# Altium project QUTMS-SHDN-BSPD-V00.PrjPcb
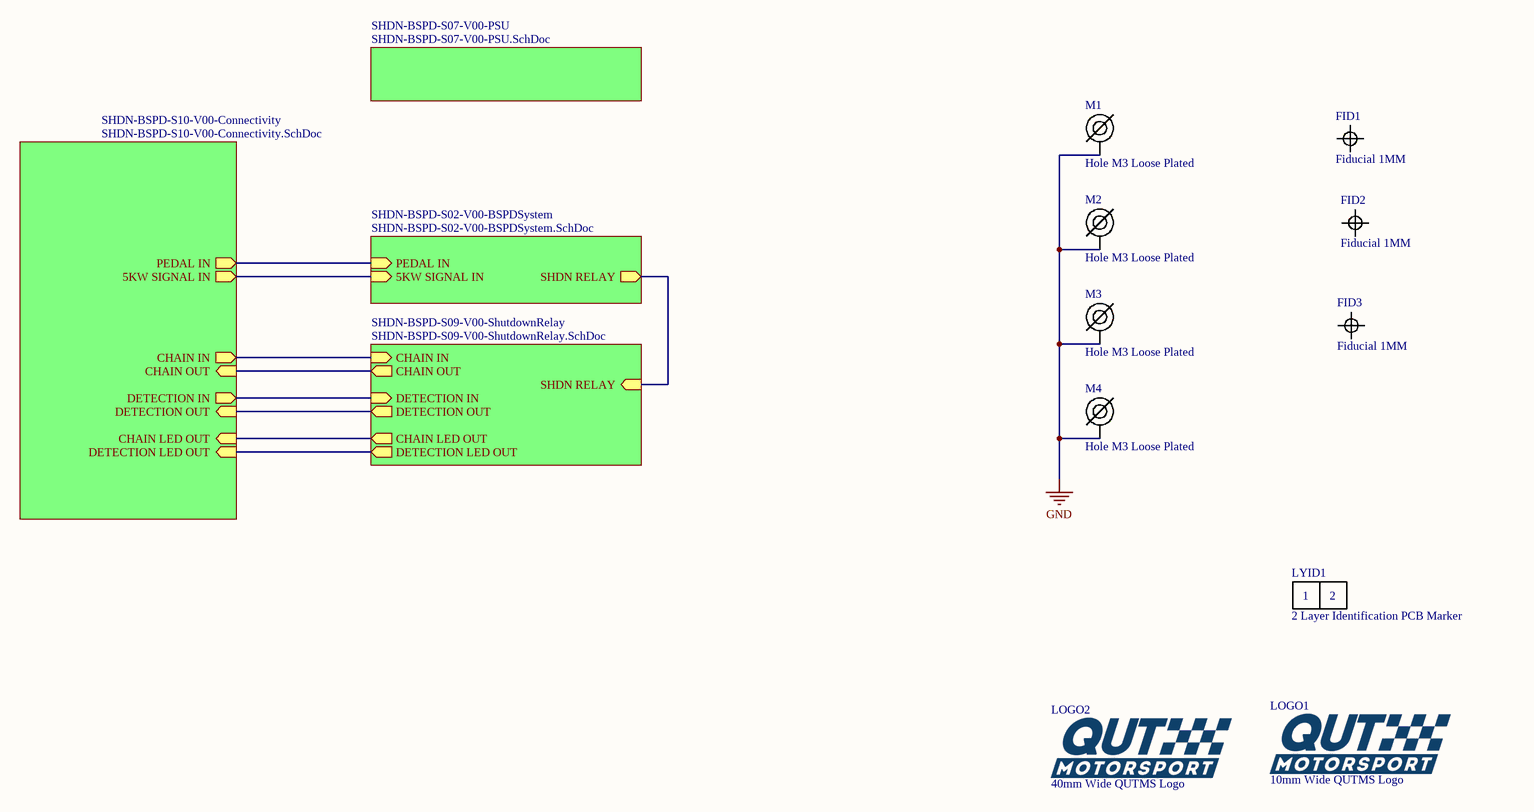
[diagram p0: SHDN-BSPD-S01-V00-BSPDBoard.SchDoc]
10 sheets, 113 parts. Net scope: hierarchical (ports join the sheet entries above them; power ports are global).
Board file: SHDN-BSPD-B01-V00.PcbDoc
Sheets:
  SHDN-BSPD-S01-V00-BSPDBoard.SchDoc
    SHDN-BSPD-S10-V00-Connectivity = SHDN-BSPD-S10-V00-Connectivity.SchDoc
    SHDN-BSPD-S02-V00-BSPDSystem = SHDN-BSPD-S02-V00-BSPDSystem.SchDoc
      SHDN-BSPD-S03-V00-BSPDWindowComparitor = SHDN-BSPD-S03-V00-BSPDWindowComparitor.SchDoc
      SHDN-BSPD-S04-V00-BSPDDelay = SHDN-BSPD-S04-V00-BSPDDelay.SchDoc
      SHDN-BSPD-S03-V00-BSPDWindowComparitor = SHDN-BSPD-S03-V00-BSPDWindowComparitor.SchDoc
    SHDN-BSPD-S07-V00-PSU = SHDN-BSPD-S07-V00-PSU.SchDoc
    SHDN-BSPD-S09-V00-ShutdownRelay = SHDN-BSPD-S09-V00-ShutdownRelay.SchDoc
  SHDN-BSPD-S05-V00-Microcontroller.SchDoc
  SHDN-BSPD-S06-V00-IsolatedCAN.SchDoc
  SHDN-BSPD-S08-V00-Buzzer.SchDoc

## Sheet SHDN-BSPD-S01-V00-BSPDBoard.SchDoc: Brake System Plausability Device - BSPD
size A3; DrawnBy: Jonn Dillon; DocumentNumber: 1; Revision: 01; SheetNumber: 1; SheetTotal: 10

### Parts
FID1  Fiducial 1MM  [FIDUCIAL 1MM]
FID2  Fiducial 1MM  [FIDUCIAL 1MM]
FID3  Fiducial 1MM  [FIDUCIAL 1MM]
LOGO1  10mm Wide QUTMS Logo  [QUTMS LOGO 10MM]
LOGO2  40mm Wide QUTMS Logo  [QUTMS LOGO 40MM]
LYID1  2 Layer Identification PCB Marker  [LAYER IDENT 2]
M1  Hole M3 Loose Plated  [M3.5 PLATED]
M2  Hole M3 Loose Plated  [M3.5 PLATED]
M3  Hole M3 Loose Plated  [M3.5 PLATED]
M4  Hole M3 Loose Plated  [M3.5 PLATED]

### Sub-sheets
SHDN-BSPD-S02-V00-BSPDSystem = SHDN-BSPD-S02-V00-BSPDSystem.SchDoc: PEDAL IN (in), 5KW SIGNAL IN (in), SHDN RELAY (out)
SHDN-BSPD-S07-V00-PSU = SHDN-BSPD-S07-V00-PSU.SchDoc: no entries
SHDN-BSPD-S09-V00-ShutdownRelay = SHDN-BSPD-S09-V00-ShutdownRelay.SchDoc: CHAIN OUT (out), CHAIN IN (in), SHDN RELAY (in), DETECTION IN (in), DETECTION OUT (out), CHAIN LED OUT (out), DETECTION LED OUT (out)
SHDN-BSPD-S10-V00-Connectivity = SHDN-BSPD-S10-V00-Connectivity.SchDoc: CHAIN IN (out), CHAIN OUT (in), PEDAL IN (out), 5KW SIGNAL IN (out), DETECTION IN (out), DETECTION OUT (in), CHAIN LED OUT (in), DETECTION LED OUT (in)

### Nets
GND: M1.1 M2.1 M3.1 M4.1
5KW SIGNAL IN: sheet SHDN-BSPD-S10-V00-Connectivity/5KW SIGNAL IN, sheet SHDN-BSPD-S02-V00-BSPDSystem/5KW SIGNAL IN
BSPD10: sheet SHDN-BSPD-S02-V00-BSPDSystem/SHDN RELAY, sheet SHDN-BSPD-S09-V00-ShutdownRelay/SHDN RELAY
CHAIN IN: sheet SHDN-BSPD-S10-V00-Connectivity/CHAIN IN, sheet SHDN-BSPD-S09-V00-ShutdownRelay/CHAIN IN
CHAIN LED: sheet SHDN-BSPD-S10-V00-Connectivity/CHAIN LED OUT, sheet SHDN-BSPD-S09-V00-ShutdownRelay/CHAIN LED OUT
CHAIN OUT: sheet SHDN-BSPD-S10-V00-Connectivity/CHAIN OUT, sheet SHDN-BSPD-S09-V00-ShutdownRelay/CHAIN OUT
DET LED: sheet SHDN-BSPD-S10-V00-Connectivity/DETECTION LED OUT, sheet SHDN-BSPD-S09-V00-ShutdownRelay/DETECTION LED OUT
DETECTION IN: sheet SHDN-BSPD-S10-V00-Connectivity/DETECTION IN, sheet SHDN-BSPD-S09-V00-ShutdownRelay/DETECTION IN
DETECTION OUT: sheet SHDN-BSPD-S10-V00-Connectivity/DETECTION OUT, sheet SHDN-BSPD-S09-V00-ShutdownRelay/DETECTION OUT
PEDAL IN: sheet SHDN-BSPD-S10-V00-Connectivity/PEDAL IN, sheet SHDN-BSPD-S02-V00-BSPDSystem/PEDAL IN

### Notes on the sheet
- Revision History:
- Sheet Title:
- Rev
- Date
- Description
- Project:
- Size:
- Drawn By:
- A3
- Number:
- Revision:
- Sheet
- Version:
- of
- QUT Motorsport
- O-120, Gardens Point
- 2 George Street
- Brisbane, QLD 4000
- Australia
- Print Date:
- Print Time:
- File Name:
- (in symbol Layer Identification 2) 1; 2

### Library data of the parts
LOGO1 = QUTMS Logo 10mm
LOGO2 = QUTMS Logo 40mm
LYID1 = Layer Identification 2
M1-M4 = Hole M3 Loose Plated: M3.5 Hole, Plated

## Sheet SHDN-BSPD-S10-V00-Connectivity.SchDoc: 8 Pin Connector
size A3; DrawnBy: Jonn Dillon; DocumentNumber: 10; Revision: 01; SheetNumber: 10; SheetTotal: 10
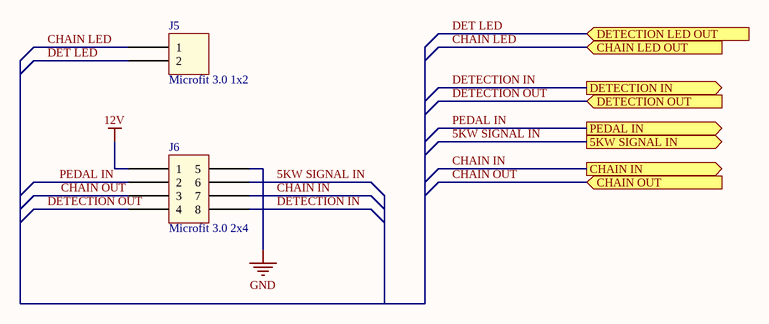
[diagram p1: SHDN-BSPD-S10-V00-Connectivity.SchDoc]

### Parts
J5  Microfit 3.0 1x2  [Microfit_1X2_R_TH]
J6  Microfit 3.0 2x4  [Microfit_2X4_R_TH]

### Ports
5KW SIGNAL IN (out), CHAIN IN (out), CHAIN LED OUT (in), CHAIN OUT (in), DETECTION IN (out), DETECTION LED OUT (in), DETECTION OUT (in), PEDAL IN (out)

### Nets
12V: J6.1
GND: J6.5
5KW SIGNAL IN: J6.6 ; port 5KW SIGNAL IN
CHAIN IN: J6.7 ; port CHAIN IN
CHAIN LED: J5.1 ; port CHAIN LED OUT
CHAIN OUT: J6.3 ; port CHAIN OUT
DET LED: J5.2 ; port DETECTION LED OUT
DETECTION IN: J6.8 ; port DETECTION IN
DETECTION OUT: J6.4 ; port DETECTION OUT
PEDAL IN: J6.2 ; port PEDAL IN

### Notes on the sheet
- Revision History:
- Sheet Title:
- Rev
- Date
- Description
- Project:
- Size:
- Drawn By:
- A3
- Number:
- Revision:
- Sheet
- Version:
- of
- QUT Motorsport
- O-120, Gardens Point
- 2 George Street
- Brisbane, QLD 4000
- Australia
- Print Date:
- Print Time:
- File Name:

### Library data of the parts
J5 = Microfit_1x2
J6 = Microfit_2x4

## Sheet SHDN-BSPD-S02-V00-BSPDSystem.SchDoc: BSPD System
size A3; DrawnBy: Jonn Dillon; DocumentNumber: 2; Revision: 01; SheetNumber: 2; SheetTotal: 10
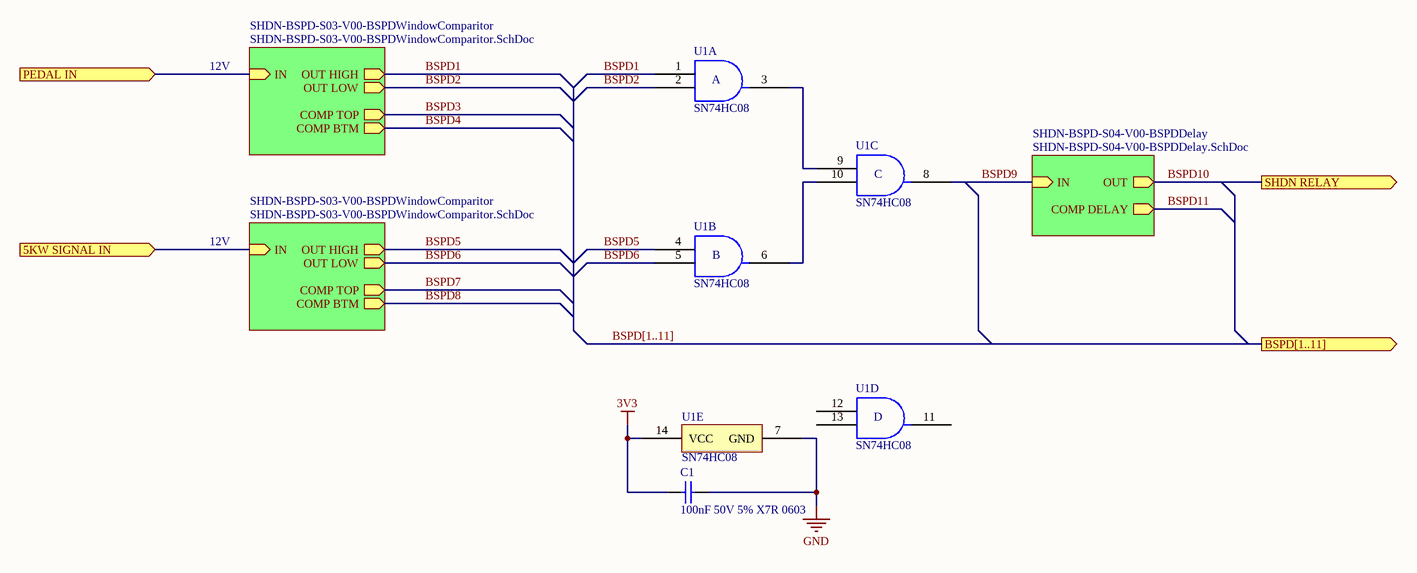
[diagram p2: SHDN-BSPD-S02-V00-BSPDSystem.SchDoc]

### Parts
C1  100nF 50V 5% X7R 0603  [Cap_Ceramic_0603]
U1  SN74HC08  [TSSOP-14]  (parts A,B,C,D,E of 5)

### Sub-sheets
SHDN-BSPD-S03-V00-BSPDWindowComparitor = SHDN-BSPD-S03-V00-BSPDWindowComparitor.SchDoc: COMP TOP (out), IN (in), COMP BTM (out), OUT HIGH (out), OUT LOW (out)
SHDN-BSPD-S03-V00-BSPDWindowComparitor = SHDN-BSPD-S03-V00-BSPDWindowComparitor.SchDoc: COMP TOP (out), IN (in), COMP BTM (out), OUT HIGH (out), OUT LOW (out)
SHDN-BSPD-S04-V00-BSPDDelay = SHDN-BSPD-S04-V00-BSPDDelay.SchDoc: IN (in), OUT (out), COMP DELAY (out)

### Ports
5KW SIGNAL IN (in), BSPD[1..11] (out), PEDAL IN (in), SHDN RELAY (out)

### Nets
3V3: C1.2 U1.14(VCC)
GND: C1.1 U1.7(GND)
5KW SIGNAL IN: port 5KW SIGNAL IN, sheet SHDN-BSPD-S03-V00-BSPDWindowComparitor/IN
BSPD1: U1.1(1A) ; sheet SHDN-BSPD-S03-V00-BSPDWindowComparitor/OUT HIGH
BSPD2: U1.2(1B) ; sheet SHDN-BSPD-S03-V00-BSPDWindowComparitor/OUT LOW
BSPD5: U1.4(2A) ; sheet SHDN-BSPD-S03-V00-BSPDWindowComparitor/OUT HIGH
BSPD6: U1.5(2B) ; sheet SHDN-BSPD-S03-V00-BSPDWindowComparitor/OUT LOW
BSPD9: U1.8(3Y) ; sheet SHDN-BSPD-S04-V00-BSPDDelay/IN
BSPD10: port SHDN RELAY, sheet SHDN-BSPD-S04-V00-BSPDDelay/OUT
PEDAL IN: port PEDAL IN, sheet SHDN-BSPD-S03-V00-BSPDWindowComparitor/IN
NetU1_3: U1.3(1Y) U1.9(3A)
NetU1_6: U1.6(2Y) U1.10(3B)

Not connected (* = marked no-connect by the designer): U1 11(4Y) 12(4A) 13(4B)

### Buses and harness runs
bus BSPD[1..11] = port BSPD[1..11]

### Notes on the sheet
- 12V
- Revision History:
- Sheet Title:
- Rev
- Date
- Description
- Project:
- Size:
- Drawn By:
- A3
- Number:
- Revision:
- Sheet
- Version:
- of
- QUT Motorsport
- O-120, Gardens Point
- 2 George Street
- Brisbane, QLD 4000
- Australia
- Print Date:
- Print Time:
- File Name:
- (in symbol SN74HC08, part A) A
- (in symbol SN74HC08, part B) B
- (in symbol SN74HC08, part C) C
- (in symbol SN74HC08, part D) D

### Library data of the parts
C1 = 100nF 50V 5% X7R 0603: Capacitor, Ceramic, SMD, 100nF, 50V, 5%, X7R, 0603
U1 = SN74HC08: Quadruple 2-Input Positive-AND Gates

## Sheet SHDN-BSPD-S03-V00-BSPDWindowComparitor.SchDoc: Window Comparitor
size A3; DrawnBy: Jonn Dillon; DocumentNumber: 3; Revision: 01; SheetNumber: 3; SheetTotal: 10
Used 2 times, as channels SHDN-BSPD-S02-V00-BSPDSystem/SHDN-BSPD-S03-V00-BSPDWindowComparitor, SHDN-BSPD-S02-V00-BSPDSystem/SHDN-BSPD-S03-V00-BSPDWindowComparitor. Parts and nets are listed once, with the designators drawn on the sheet.
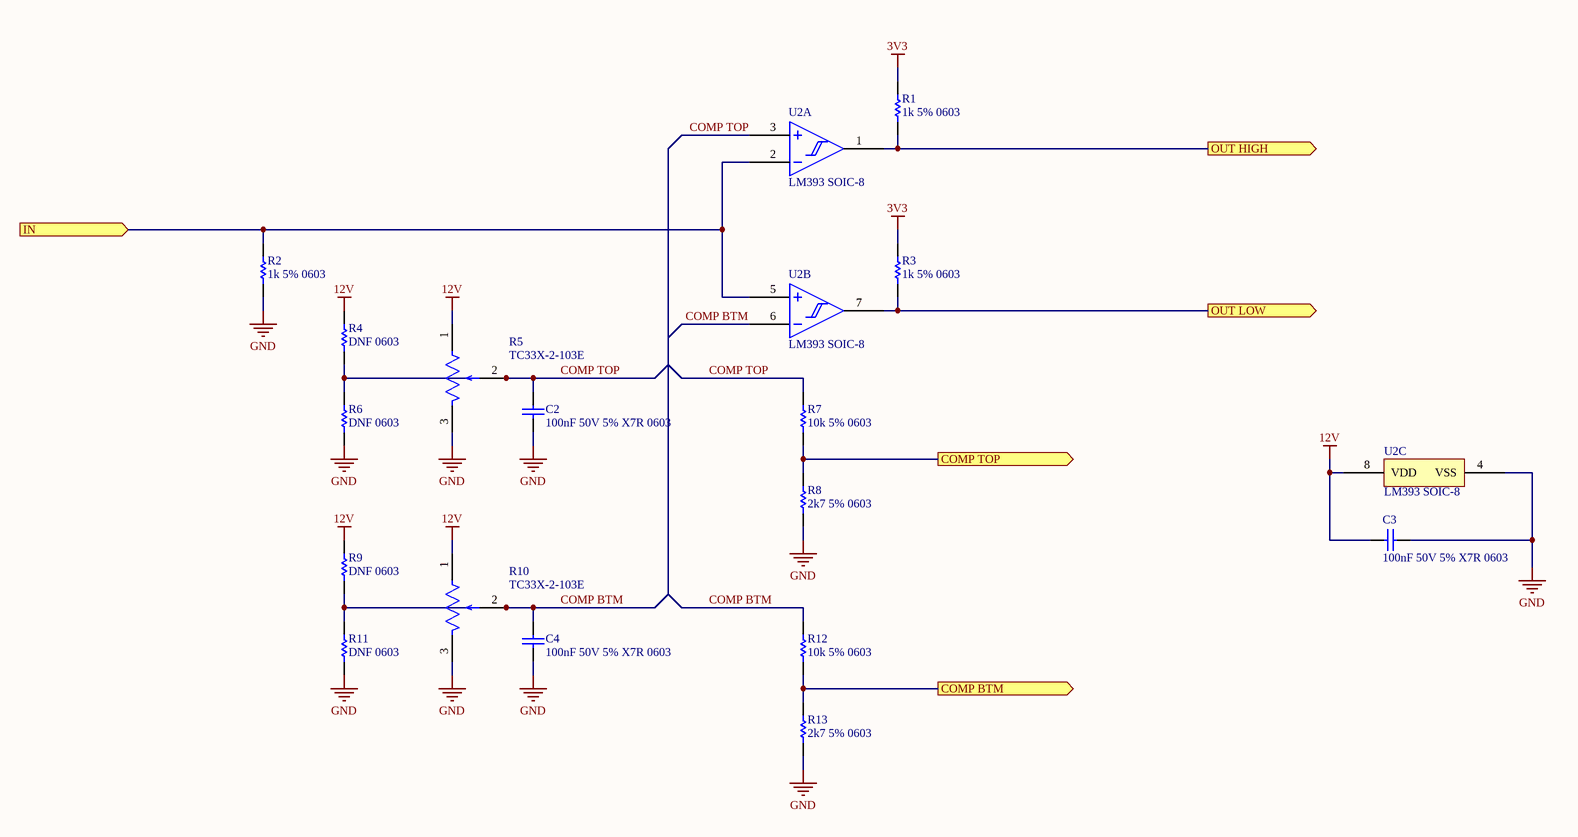
[diagram p3: SHDN-BSPD-S03-V00-BSPDWindowComparitor.SchDoc]

### Parts
C2  100nF 50V 5% X7R 0603  [Cap_Ceramic_0603]
C3  100nF 50V 5% X7R 0603  [Cap_Ceramic_0603]
C4  100nF 50V 5% X7R 0603  [Cap_Ceramic_0603]
R1  1k 5% 0603  [Res_ThinFilm_0603]
R2  1k 5% 0603  [Res_ThinFilm_0603]
R3  1k 5% 0603  [Res_ThinFilm_0603]
R4  DNF 0603  [Res_ThinFilm_0603]
R5  TC33X-2-103E  [TC33]
R6  DNF 0603  [Res_ThinFilm_0603]
R7  10k 5% 0603  [Res_ThinFilm_0603]
R8  2k7 5% 0603  [Res_ThinFilm_0603]
R9  DNF 0603  [Res_ThinFilm_0603]
R10  TC33X-2-103E  [TC33]
R11  DNF 0603  [Res_ThinFilm_0603]
R12  10k 5% 0603  [Res_ThinFilm_0603]
R13  2k7 5% 0603  [Res_ThinFilm_0603]
U2  LM393 SOIC-8  [SOIC-8]  (parts A,B,C of 3)

### Ports
COMP BTM (out), COMP TOP (out), IN (in), OUT HIGH (out), OUT LOW (out)

### Nets
3V3: R1.2 R3.2
12V: C3.1 R4.2 R5.1 R9.2 R10.1 U2.8(VDD)
GND: C2.1 C3.2 C4.1 R2.1 R5.3 R6.1 R8.1 R10.3 R11.1 R13.1 U2.4(VSS)
COMP BTM: C4.2 R9.1 R10.2 R11.2 R12.1 U2.6(IN2-)
COMP BTM: R12.2 R13.2 ; port COMP BTM  [a separate net that carries the same name]
COMP TOP: C2.2 R4.1 R5.2 R6.2 R7.1 U2.3(IN1+)
COMP TOP: R7.2 R8.2 ; port COMP TOP  [a separate net that carries the same name]
IN: R2.2 U2.2(IN1-) U2.5(IN2+) ; port IN
OUT HIGH: R1.1 U2.1(OUT1) ; port OUT HIGH
OUT LOW: R3.1 U2.7(OUT1) ; port OUT LOW

### Channels
SHDN-BSPD-S02-V00-BSPDSystem/SHDN-BSPD-S03-V00-BSPDWindowComparitor: designators end in B; ports COMP BTM=BSPD4 COMP TOP=BSPD3 IN=PEDAL IN OUT HIGH=BSPD1 OUT LOW=BSPD2
SHDN-BSPD-S02-V00-BSPDSystem/SHDN-BSPD-S03-V00-BSPDWindowComparitor: designators end in A; ports COMP BTM=BSPD8 COMP TOP=BSPD7 IN=5KW SIGNAL IN OUT HIGH=BSPD5 OUT LOW=BSPD6

### Notes on the sheet
- Revision History:
- Sheet Title:
- Rev
- Date
- Description
- Project:
- Size:
- Drawn By:
- A3
- Number:
- Revision:
- Sheet
- Version:
- of
- QUT Motorsport
- O-120, Gardens Point
- 2 George Street
- Brisbane, QLD 4000
- Australia
- Print Date:
- Print Time:
- File Name:

### Library data of the parts
C2-C4 = 100nF 50V 5% X7R 0603: as C1 on sheet SHDN-BSPD-S02-V00-BSPDSystem
R1-R3 = 1k 5% 0603: Resistor, SMD, 1k, 0.1W, 5%, 0603
R4 R6 R9 R11 = DNF 0603: Resistor, SMD, DNF, 0.1W, 0603
R5 R10 = TC33X-2-103E: 10 kOhms 0.1W, 1/10W J Lead Surface Mount Trimmer Potentiometer Cermet 1 Turn Top Adjustment
R7 R12 = 10k 5% 0603: Resistor, SMD, 10k, 0.1W, 5%, 0603
R8 R13 = 2k7 5% 0603: Resistor, SMD, 2k7, 0.1W, 5%, 0603
U2 = LM393: General Purpose Comparitor 2 Circuit 8-SOIC

## Sheet SHDN-BSPD-S04-V00-BSPDDelay.SchDoc: RC Charging Delay
size A3; DrawnBy: Jonn Dillon; DocumentNumber: 4; Revision: 01; SheetNumber: 4; SheetTotal: 10
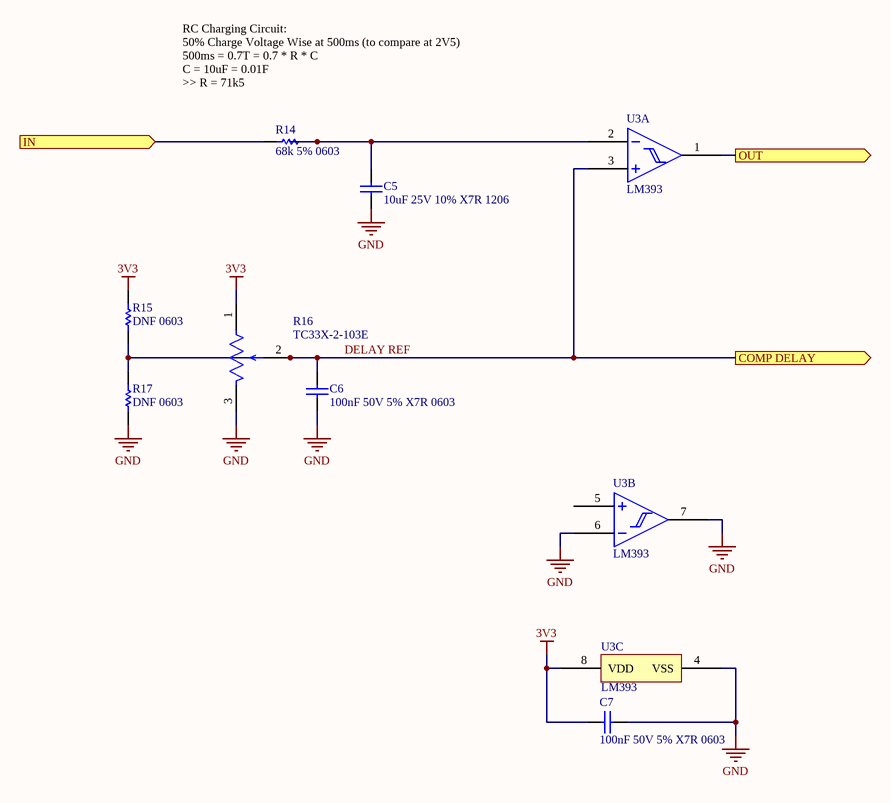
[diagram p4: SHDN-BSPD-S04-V00-BSPDDelay.SchDoc]

### Parts
C5  10uF 25V 10% X7R 1206  [Cap_Ceramic_1206]
C6  100nF 50V 5% X7R 0603  [Cap_Ceramic_0603]
C7  100nF 50V 5% X7R 0603  [Cap_Ceramic_0603]
R14  68k 5% 0603  [Res_ThinFilm_0603]
R15  DNF 0603  [Res_ThinFilm_0603]
R16  TC33X-2-103E  [TC33]
R17  DNF 0603  [Res_ThinFilm_0603]
U3  LM393  [TSSOP-8]  (parts A,B,C of 3)

### Ports
COMP DELAY (out), IN (in), OUT (out)

### Nets
3V3: C7.2 R15.2 R16.1 U3.8(VDD)
GND: C5.1 C6.1 C7.1 R16.3 R17.1 U3.4(VSS) U3.6(IN2-) U3.7(OUT1)
BSPD9: R14.1 ; port IN
BSPD10: U3.1(OUT1) ; port OUT
DELAY REF: C6.2 R15.1 R16.2 R17.2 U3.3(IN1+) ; port COMP DELAY  [project net BSPD11]
NetC5_2: C5.2 R14.2 U3.2(IN1-)

Not connected (* = marked no-connect by the designer): U3 5(IN2+)

### Notes on the sheet
- RC Charging Circuit:
  50% Charge Voltage Wise at 500ms (to compare at 2V5)
  500ms = 0.7T = 0.7 * R * C
  C = 10uF = 0.01F
  >> R = 71k5
- Revision History:
- Sheet Title:
- Rev
- Date
- Description
- Project:
- Size:
- Drawn By:
- A3
- Number:
- Revision:
- Sheet
- Version:
- of
- QUT Motorsport
- O-120, Gardens Point
- 2 George Street
- Brisbane, QLD 4000
- Australia
- Print Date:
- Print Time:
- File Name:

### Library data of the parts
C5 = 10uF 25V 10% X7R 1206: Capacitor, Ceramic, SMD, 10uF, 25V, 10%, X7R, 1206
C6 C7 = 100nF 50V 5% X7R 0603: as C1 on sheet SHDN-BSPD-S02-V00-BSPDSystem
R14 = 68k 5% 0603: Resistor, SMD, 68k, 0.1W, 5%, 0603
R15 R17 = DNF 0603: Resistor, SMD, DNF, 0.1W, 0603
R16 = TC33X-2-103E: as R5 on sheet SHDN-BSPD-S03-V00-BSPDWindowComparitor
U3 = LM393: as U2 on sheet SHDN-BSPD-S03-V00-BSPDWindowComparitor

## Sheet SHDN-BSPD-S07-V00-PSU.SchDoc: Power Supply (20-40V to 3v3 @ 0.1-0.6A)
size A3; DrawnBy: Jonn Dillon; DocumentNumber: 7; Revision: 01; SheetNumber: 7; SheetTotal: 10; Version: 01; Project: Battery Management System 2020; PageSetup: Record=PageOptions|CenterHorizontal=True|CenterVertical=True|PrintScale=0.97|XCorrection=1.00|YCorrection=1.00|PrintKind=0|BorderSize=5000000|LeftOffset=0|BottomOffset=0|Orientation=2|PaperLength=1000|PaperWidth=1000|Scale=100|PaperSource=7|PrintQuality=-4|MediaType=1|DitherType=10|PaperKind=A4|PrintScaleMode=1
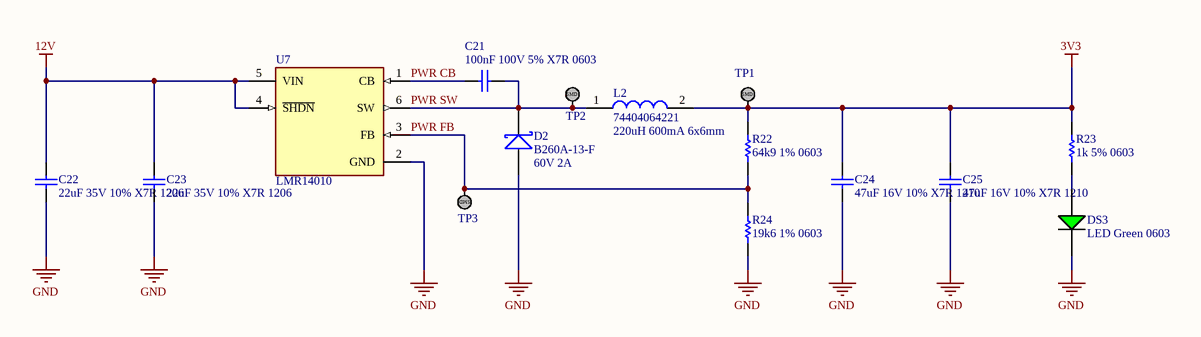
[diagram p5: SHDN-BSPD-S07-V00-PSU.SchDoc]

### Parts
C21  100nF 100V 5% X7R 0603  [Cap_Ceramic_0603]
C22  22uF 35V 10% X7R 1206  [Cap_Ceramic_1206]
C23  22uF 35V 10% X7R 1206  [Cap_Ceramic_1206]
C24  47uF 16V 10% X7R 1210  [Cap_Ceramic_1210]
C25  47uF 16V 10% X7R 1210  [Cap_Ceramic_1210]
D2  B260A-13-F  [SMA]
DS3  LED Green 0603  [LED GREEN 0603]
L2  74404064221  [Inductor_6x6mm]
R22  64k9 1% 0603  [Res_ThinFilm_0603]
R23  1k 5% 0603  [Res_ThinFilm_0603]
R24  19k6 1% 0603  [Res_ThinFilm_0603]
TP1  TestPoint_SMD  [TestPointSMD]  (value not drawn)
TP2  TestPoint_SMD  [TestPointSMD]  (value not drawn)
TP3  TestPoint_SMD  [TestPointSMD]  (value not drawn)
U7  LMR14010  [LMR14010]

### Nets
3V3: C24.2 C25.2 L2.2 R22.2 R23.2 TP1.1
12V: C22.2 C23.2 U7.4(~{SHDN}) U7.5(VIN)
GND: C22.1 C23.1 C24.1 C25.1 D2.A DS3.2(C) R24.1 U7.2(GND)
PWR CB: C21.1 U7.1(CB)
PWR FB: R22.1 R24.2 TP3.1 U7.3(FB)
PWR SW: C21.2 D2.K L2.1 TP2.1 U7.6(SW)
NetDS3_1: DS3.1(A) R23.1

### Notes on the sheet
- (near L2) 220uH 600mA 6x6mm
- (near D2) 60V 2A
- Revision History:
- Sheet Title:
- Rev
- Date
- Description
- Project:
- Size:
- Drawn By:
- A3
- Number:
- Revision:
- Sheet
- Version:
- of
- QUT Motorsport
- O-120, Gardens Point
- 2 George Street
- Brisbane, QLD 4000
- Australia
- Print Date:
- Print Time:
- File Name:
- (in symbol TestPoint_SMD) SMD

### Library data of the parts
C21 = 100nF 100V 5% X7R 0603: Capacitor, Ceramic, SMD, 100nF, 100V, 5%, X7R, 0603
C22 C23 = 22uF 35V 10% X7R 1206: Capacitor, Ceramic, SMD, 22uF, 35V, 10%, X7R, 1206
C24 C25 = 47uF 16V 10% X7R 1210: Capacitor, Ceramic, SMD, 47uF, 16V, 5%, X7R, 1210
D2 = B260A-13-F: Diode, Schottky Barrier Rectifier, 60 V, 2 A, B260A-13-F
L2 = 74404064221: FIXED IND 220UH 660MA 850 MOHM; ComponentLink1Description: Digikey; ComponentLink1URL: https://www.digikey.com.au/product-detail/en/w%C3%BCrth-elektronik/74404064221/732-7261-1-ND/5353241; ComponentLink2Description: LCSC A; ComponentLink2URL: https://lcsc.com/product-detail/Power-Inductors_Sunlord-SWPA6045S221MT_C91047.html; ComponentLink3Description: LCSC B; ComponentLink3URL: https://lcsc.com/product-detail/Power-Inductors_SXN-Shun-Xiang-Nuo-Elec-SMNR6045-221MT_C467145.html
R22 = 64k9 1% 0603: Resistor, SMD, 64k9, 0.1W, 5%, 0603
R23 = 1k 5% 0603: Resistor, SMD, 1k, 0.1W, 5%, 0603
R24 = 19k6 1% 0603: Resistor, SMD, 19k6, 0.1W, 5%, 0603

## Sheet SHDN-BSPD-S09-V00-ShutdownRelay.SchDoc: Shutdown Relay
size A3; DrawnBy: Jonn Dillon; DocumentNumber: 9; Revision: 01; SheetNumber: 9; SheetTotal: 10
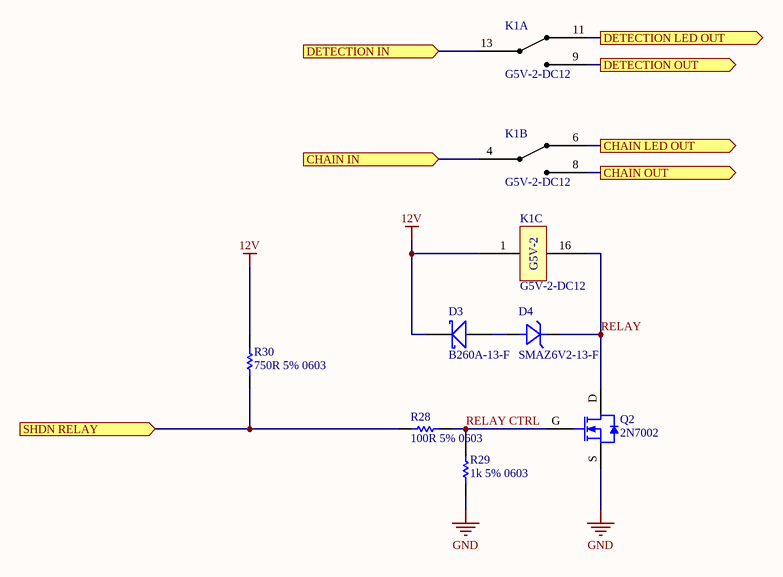
[diagram p6: SHDN-BSPD-S09-V00-ShutdownRelay.SchDoc]

### Parts
D3  B260A-13-F  [SMA]
D4  SMAZ6V2-13-F  [SMA]
K1  G5V-2-DC12  [G5V-2]  (parts A,B,C of 3)
Q2  2N7002  [SOT23-3]
R28  100R 5% 0603  [Res_ThinFilm_0603]
R29  1k 5% 0603  [Res_ThinFilm_0603]
R30  750R 5% 0603  [Res_ThinFilm_0603]

### Ports
CHAIN IN (in), CHAIN LED OUT (out), CHAIN OUT (out), DETECTION IN (in), DETECTION LED OUT (out), DETECTION OUT (out), SHDN RELAY (in)

### Nets
12V: D3.K K1.1 R30.2
GND: Q2.S R29.1
BSPD10: R28.1 R30.1 ; port SHDN RELAY
CHAIN IN: K1.4 ; port CHAIN IN
CHAIN LED: K1.6 ; port CHAIN LED OUT
CHAIN OUT: K1.8 ; port CHAIN OUT
DET LED: K1.11 ; port DETECTION LED OUT
DETECTION IN: K1.13 ; port DETECTION IN
DETECTION OUT: K1.9 ; port DETECTION OUT
RELAY: D4.K(Cathode) K1.16 Q2.D
RELAY CTRL: Q2.G R28.2 R29.2
NetD3_A: D3.A D4.A(Anode)

### Notes on the sheet
- Revision History:
- Sheet Title:
- Rev
- Date
- Description
- Project:
- Size:
- Drawn By:
- A3
- Number:
- Revision:
- Sheet
- Version:
- of
- QUT Motorsport
- O-120, Gardens Point
- 2 George Street
- Brisbane, QLD 4000
- Australia
- Print Date:
- Print Time:
- File Name:
- (in symbol G5V-2-DC12, part C) G5V-2

### Library data of the parts
D3 = B260A-13-F: as D2 on sheet SHDN-BSPD-S07-V00-PSU
D4 = SMAZ6V2-13-F: Zener Diode 6.2V 1W ±5% Surface Mount SMA; Manufacturer: Generic; MPN: 5V6 500mW SMA
K1 = G5V-2-DC12: General Purpose Relay DPDT (2 Form C) Through Hole, 12V, 2A
R28 = 100R 5%, 0603: Resistor, SMD, 100R, 0.1W, 5%, 0603
R29 = 1k 5% 0603: Resistor, SMD, 1k, 0.1W, 5%, 0603
R30 = 820R 5% 0603: Resistor, SMD, 750R, 0.1W, 5%, 0603

## Sheet SHDN-BSPD-S05-V00-Microcontroller.SchDoc: Microcontroller
size A3; DrawnBy: Jonn DIllon; DocumentNumber: 5; Revision: 01; SheetNumber: 5; SheetTotal: 10; Version: 01; Project: Shutdown Board 2020; PageSetup: Record=PageOptions|CenterHorizontal=True|CenterVertical=True|PrintScale=0.97|XCorrection=1.00|YCorrection=1.00|PrintKind=0|BorderSize=5000000|LeftOffset=0|BottomOffset=0|Orientation=2|PaperLength=1000|PaperWidth=1000|Scale=100|PaperSource=7|PrintQuality=-4|MediaType=1|DitherType=10|PaperKind=A4|PrintScaleMode=1
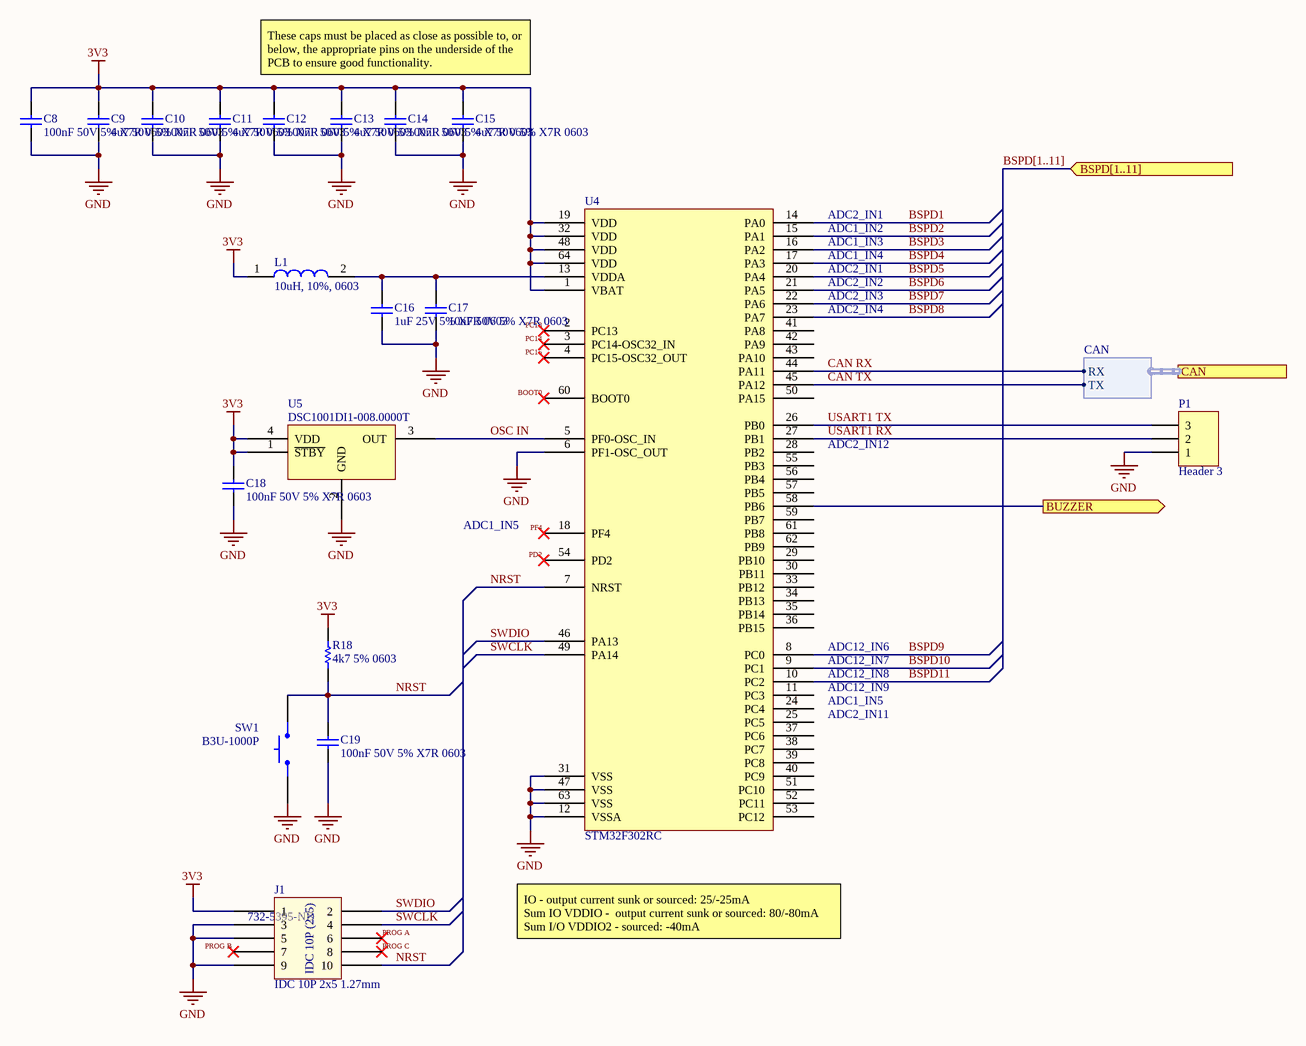
[diagram p7: SHDN-BSPD-S05-V00-Microcontroller.SchDoc]

### Parts
C8  100nF 50V 5% X7R 0603  [Cap_Ceramic_0603]
C9  4u7 50V 5% X7R 0603  [Cap_Ceramic_0603]
C10  100nF 50V 5% X7R 0603  [Cap_Ceramic_0603]
C11  4u7 50V 5% X7R 0603  [Cap_Ceramic_0603]
C12  100nF 50V 5% X7R 0603  [Cap_Ceramic_0603]
C13  4u7 50V 5% X7R 0603  [Cap_Ceramic_0603]
C14  100nF 50V 5% X7R 0603  [Cap_Ceramic_0603]
C15  4u7 50V 5% X7R 0603  [Cap_Ceramic_0603]
C16  1uF 25V 5% X7R 0603  [Cap_Ceramic_0603]
C17  10nF 50V 5% X7R 0603  [Cap_Ceramic_0603]
C18  100nF 50V 5% X7R 0603  [Cap_Ceramic_0603]
C19  100nF 50V 5% X7R 0603  [Cap_Ceramic_0603]
J1  IDC 10P 2x5 1.27mm  [IDC 1.27MM 10P]
L1  10uH, 10%, 0603  [Inductor_0603]
P1  Header 3  [HDR1X3]
R18  4k7 5% 0603  [Res_ThinFilm_0603]
SW1  B3U-1000P  [BTN B3U-1000P]
U4  STM32F302RC  [STM32F302RC]
U5  DSC1001DI1-008.0000T  [DSC1001DI1-008.0000TCT-ND]

### Ports
BSPD[1..11] (in), BUZZER (out), CAN (harness CAN)

### Harnesses
CAN: RX, TX

### Nets
3V3: C8.2 C9.2 C10.2 C11.2 C12.2 C13.2 C14.2 C15.2 C18.2 J1.1 L1.1 R18.2 U4.1(VBAT) U4.19(VDD) U4.32(VDD) U4.48(VDD) U4.64(VDD) U5.1(~{STBY}) U5.4(VDD)
GND: C8.1 C9.1 C10.1 C11.1 C12.1 C13.1 C14.1 C15.1 C16.1 C17.1 C18.1 C19.1 J1.3 J1.5 J1.9 P1.1 SW1.1 U4.6(PF1-OSC_OUT) U4.12(VSSA) U4.31(VSS) U4.47(VSS) U4.63(VSS) U5.2(GND)
BOOT0: U4.60(BOOT0)
BSPD1: U4.14(PA0)
BSPD2: U4.15(PA1)
BSPD3: U4.16(PA2)
BSPD4: U4.17(PA3)
BSPD5: U4.20(PA4)
BSPD6: U4.21(PA5)
BSPD7: U4.22(PA6)
BSPD8: U4.23(PA7)
BSPD9: U4.8(PC0)
BSPD10: U4.9(PC1)
BSPD11: U4.10(PC2)
CAN RX: U4.44(PA11) ; port CAN.RX
CAN TX: U4.45(PA12) ; port CAN.TX
NRST: C19.2 J1.10 R18.1 SW1.2 U4.7(NRST)
OSC IN: U4.5(PF0-OSC_IN) U5.3(OUT)
PC13: U4.2(PC13)
PC14: U4.3(PC14-OSC32_IN)
PC15: U4.4(PC15-OSC32_OUT)
PD2: U4.54(PD2)
PF4: U4.18(PF4)
PROG A: J1.6
PROG B: J1.7
PROG C: J1.8
SWCLK: J1.4 U4.49(PA14)
SWDIO: J1.2 U4.46(PA13)
USART1 RX: P1.2 U4.27(PB1)
USART1 TX: P1.3 U4.26(PB0)
NetC16_2: C16.2 C17.2 L1.2 U4.13(VDDA)
NetU4_58: U4.58(PB6) ; port BUZZER

Not connected (* = marked no-connect by the designer): U4 11(PC3) 24(PC4) 25(PC5) 28(PB2) 29(PB10) 30(PB11) 33(PB12) 34(PB13) 35(PB14) 36(PB15) 37(PC6) 38(PC7) 39(PC8) 40(PC9) 41(PA8) 42(PA9) 43(PA10) 50(PA15) 51(PC10) 52(PC11) 53(PC12) 55(PB3) 56(PB4) 57(PB5) 59(PB7) 61(PB8) 62(PB9)

### Buses and harness runs
bus BSPD[1..11] = port BSPD[1..11]

### Notes on the sheet
- These caps must be placed as close as possible to, or below, the appropriate pins on the underside of the PCB to ensure good functionality.
- ADC2_IN1
- ADC2_IN2
- ADC1_IN4
- ADC1_IN3
- ADC1_IN2
- ADC2_IN4
- ADC2_IN3
- ADC2_IN12
- ADC1_IN5
- ADC12_IN6
- ADC12_IN7
- ADC12_IN8
- ADC12_IN9
- ADC2_IN11
- (near J1) 732-5395-ND
- IO - output current sunk or sourced: 25/-25mA
  Sum IO VDDIO -  output current sunk or sourced: 80/-80mA
  Sum I/O VDDIO2 - sourced: -40mA
- Revision History:
- Sheet Title:
- Rev
- Date
- Description
- Project:
- Size:
- Drawn By:
- A3
- Number:
- Revision:
- Sheet
- Version:
- of
- QUT Motorsport
- O-120, Gardens Point
- 2 George Street
- Brisbane, QLD 4000
- Australia
- Print Date:
- Print Time:
- File Name:
- (in symbol IDC 10P 2x5 1.27mm) IDC 10P (2x5)

### Library data of the parts
C8 C10 C12 C14 C18 C19 = 100nF 50V 5% X7R 0603: as C1 on sheet SHDN-BSPD-S02-V00-BSPDSystem
C9 C11 C13 C15 = 4u7 50V 5% X7R 0603: Capacitor, Ceramic, SMD, 4u7, 50V, 5%, X7R, 0603
C16 = 1uF 25V 5% X7R 0603: Capacitor, Ceramic, SMD, 1uF, 25V, 5%, X7R, 0603
C17 = 10nF 50V 5% X7R 0603: Capacitor, Ceramic, SMD, 10nF, 50V, 5%, X7R, 0603
P1 = Header 3: Header, 3-Pin; LatestRevisionDate: 17-Jul-2002; LatestRevisionNote: Re-released for DXP Platform.; Publisher: Altium Limited
R18 = 4k7 5% 0603: Resistor, SMD, 4k7, 0.1W, 5%, 0603
SW1 = BTN B3U-1000P: Omron B3U-1000P Ultra Miniture Switch; ComponentLink1Description: LCSC; ComponentLink1URL: https://lcsc.com/product-detail/Tactile-Switches_BRIGHT-TSA063G50-250_C294565.html
U4 = STM32F302RC: ARM® Cortex®-M4 STM32F3 Microcontroller IC 32-Bit 72MHz 256KB (256K x 8) FLASH 64-LQFP (10x10); ComponentLink1Description: Digikey; ComponentLink1URL: https://www.digikey.com.au/product-detail/en/stmicroelectronics/STM32F302RCT6TR/497-19000-1-ND/9974332; ComponentLink2Description: Datasheet; ComponentLink2URL: http://www.st.com/content/ccc/resource/technical/document/datasheet/67/73/21/b9/f2/b3/4d/f8/DM00094064.pdf/files/DM00094064.pdf/jcr:content/translations/en.DM00094064.pdf
U5 = DSC1001DI1-008.0000T: 8MHz XO (Standard) CMOS Oscillator 1.8 ~ 3.3V Standby (Power Down) 4-SMD, No Lead
L1 = 10uH, 10%, 0603: ComponentLink1Description: Digikey; ComponentLink1URL: https://www.digikey.com.au/product-detail/en/w%C3%BCrth-elektronik/74404064221/732-7261-1-ND/5353241; ComponentLink2Description: LCSC A; ComponentLink2URL: https://lcsc.com/product-detail/Power-Inductors_Sunlord-SWPA6045S221MT_C91047.html; ComponentLink3Description: LCSC B; ComponentLink3URL: https://lcsc.com/product-detail/Power-Inductors_SXN-Shun-Xiang-Nuo-Elec-SMNR6045-221MT_C467145.html

## Sheet SHDN-BSPD-S06-V00-IsolatedCAN.SchDoc: Isolated CANBUS @ 3V3
size A3; DrawnBy: Jonn Dillon; DocumentNumber: 6; Revision: 01; SheetNumber: 6; SheetTotal: 10; Version: 01; Project: Battery Managment System 2020; PageSetup: Record=PageOptions|CenterHorizontal=True|CenterVertical=True|PrintScale=0.97|XCorrection=1.00|YCorrection=1.00|PrintKind=0|BorderSize=5000000|LeftOffset=0|BottomOffset=0|Orientation=2|PaperLength=1000|PaperWidth=1000|Scale=100|PaperSource=7|PrintQuality=-4|MediaType=1|DitherType=10|PaperKind=A4|PrintScaleMode=1
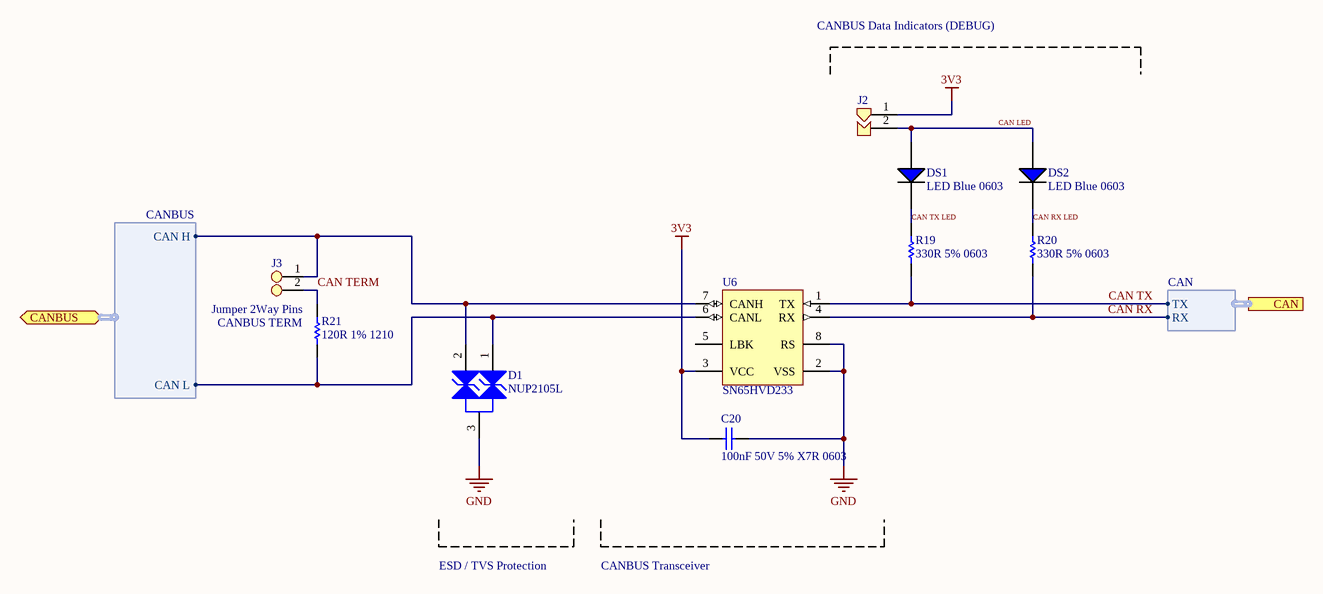
[diagram p8: SHDN-BSPD-S06-V00-IsolatedCAN.SchDoc]

### Parts
C20  100nF 50V 5% X7R 0603  [Cap_Ceramic_0603]
D1  NUP2105L  [NUP2105L]
DS1  LED Blue 0603  [LED BLUE 0603]
DS2  LED Blue 0603  [LED BLUE 0603]
J2  Jumper 2Way Solderable  [Jumper_2Way_Solderable]  (value not drawn)
J3  Jumper 2Way Pins  [Jumper_2Way_Pin]
R19  330R 5% 0603  [Res_ThinFilm_0603]
R20  330R 5% 0603  [Res_ThinFilm_0603]
R21  120R 1% 1210  [Res_ThinFilm_1210]
U6  SN65HVD233  [SN65HVD233DR]

### Ports
CAN (harness CAN), CANBUS (bidir, harness CANBUS)

### Harnesses
CANBUS: CAN H, CAN L
CAN: RX, TX

### Nets
3V3: C20.2 J2.1 U6.3(VCC)
GND: C20.1 D1.3 U6.2(VSS) U6.8(RS)
CAN LED: DS1.1(A) DS2.1(A) J2.2
CAN RX: R20.1 U6.4(RX) ; port CAN.RX
CAN RX LED: DS2.2(C) R20.2
CAN TERM: J3.2 R21.2
CAN TX: R19.1 U6.1(TX) ; port CAN.TX
CAN TX LED: DS1.2(C) R19.2
NetD1_1: D1.1 R21.1 U6.6(CANL) ; port CANBUS.CAN L
NetD1_2: D1.2 J3.1 U6.7(CANH) ; port CANBUS.CAN H

Not connected (* = marked no-connect by the designer): U6 5(LBK)

### Notes on the sheet
- CANBUS Data Indicators (DEBUG)
- (near R21) CANBUS TERM
- ESD / TVS Protection
- CANBUS Transceiver
- Revision History:
- Sheet Title:
- Rev
- Date
- Description
- Project:
- Size:
- Drawn By:
- A3
- Number:
- Revision:
- Sheet
- Version:
- of
- QUT Motorsport
- O-120, Gardens Point
- 2 George Street
- Brisbane, QLD 4000
- Australia
- Print Date:
- Print Time:
- File Name:

### Library data of the parts
C20 = 100nF 50V 5% X7R 0603: as C1 on sheet SHDN-BSPD-S02-V00-BSPDSystem
J2 = Jumper 2Way Side Solderable
J3 = Jumper 2Way Side Pins
R19 R20 = 330R 5% 0603: Resistor, SMD, 330R, 0.1W, 5%, 0603
R21 = 120R 1% 1210: Resistor, SMD, 120R, 0.25W, 1%, 1210
D1 = NUP2105L: ComponentLink1Description: Datasheet; ComponentLink1URL: https://www.onsemi.cn/PowerSolutions/document/NUP2105L-D.PDF; ComponentLink2Description: LCSC; ComponentLink2URL: https://lcsc.com/product-detail/TVS_ON-Semiconductor-NUP2105LT1G_C14486.html; ComponentLink3Description: Digikey; ComponentLink3URL: https://www.digikey.com.au/product-detail/en/on-semiconductor/SZNUP2105LT1G/SZNUP2105LT1GOSCT-ND/3487669
U6 = SN65HVD233: ComponentLink1Description: LCSC; ComponentLink1URL: https://lcsc.com/product-detail/CAN-ICs_Texas-Instruments_SN65HVD233DRG4_Texas-Instruments-Texas-Instruments-SN65HVD233DRG4_C61643.html; ComponentLink2Description: Digikey; ComponentLink2URL: https://www.digikey.com.au/product-detail/en/texas-instruments/SN65HVD233DR/296-35967-1-ND/4134960; ComponentLink3Description: Datasheet; ComponentLink3URL: https://www.ti.com/lit/ds/symlink/sn65hvd233.pdf?ts=1588560888178; ComponentLink4Description: Ti Product Page; ComponentLink4URL: https://www.ti.com/product/SN65HVD233

## Sheet SHDN-BSPD-S08-V00-Buzzer.SchDoc: Buzzer
size A3; DrawnBy: John Dillon; DocumentNumber: 8; Revision: 01; SheetNumber: 8; SheetTotal: 10
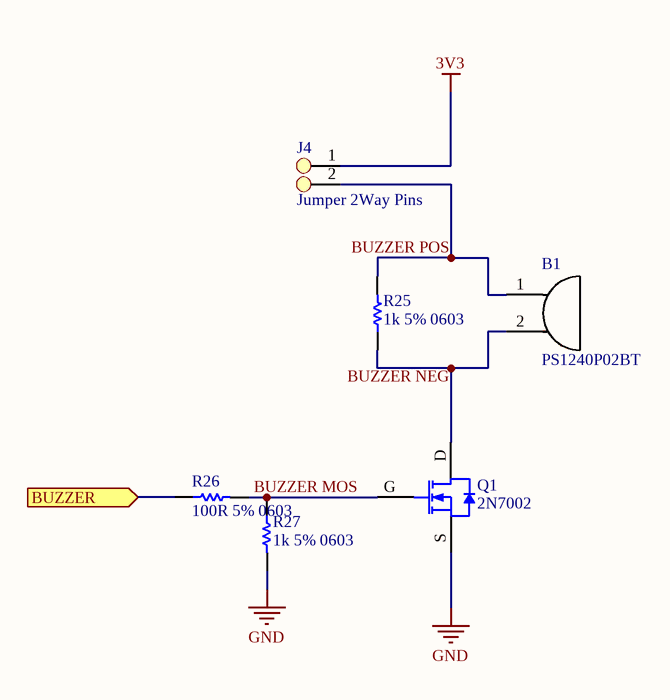
[diagram p9: SHDN-BSPD-S08-V00-Buzzer.SchDoc]

### Parts
B1  PS1240P02BT  [PS1240P02BT]
J4  Jumper 2Way Pins  [Jumper_2Way_Pin]
Q1  2N7002  [SOT23-3]
R25  1k 5% 0603  [Res_ThinFilm_0603]
R26  100R 5% 0603  [Res_ThinFilm_0603]
R27  1k 5% 0603  [Res_ThinFilm_0603]

### Ports
BUZZER (in)

### Nets
3V3: J4.1
GND: Q1.S R27.2
BUZZER MOS: Q1.G R26.2 R27.1
BUZZER NEG: B1.2 Q1.D R25.1
BUZZER POS: B1.1 J4.2 R25.2
NetR26_1: R26.1 ; port BUZZER

### Notes on the sheet
- Revision History:
- Sheet Title:
- Rev
- Date
- Description
- Project:
- Size:
- Drawn By:
- A3
- Number:
- Revision:
- Sheet
- Version:
- of
- QUT Motorsport
- O-120, Gardens Point
- 2 George Street
- Brisbane, QLD 4000
- Australia
- Print Date:
- Print Time:
- File Name:

### Library data of the parts
B1 = PS1240P02BT: Buzzers Transducer, Externally Driven Piezo 3V 4kHz 60dB @ 3V, 10cm Through Hole PC Pins
J4 = Jumper 2Way Side Pins
R25 R27 = 1k 5% 0603: Resistor, SMD, 1k, 0.1W, 5%, 0603
R26 = 100R 5%, 0603: Resistor, SMD, 100R, 0.1W, 5%, 0603

## Nets that join several sheets
3V3: SHDN-BSPD-S02-V00-BSPDSystem (C1.2 U1.14), SHDN-BSPD-S02-V00-BSPDSystem/SHDN-BSPD-S03-V00-BSPDWindowComparitor (R1B.2 R3B.2), SHDN-BSPD-S04-V00-BSPDDelay (C7.2 R15.2 R16.1 U3.8), SHDN-BSPD-S02-V00-BSPDSystem/SHDN-BSPD-S03-V00-BSPDWindowComparitor (R1A.2 R3A.2), SHDN-BSPD-S07-V00-PSU (6 pins), SHDN-BSPD-S05-V00-Microcontroller (19 pins), SHDN-BSPD-S06-V00-IsolatedCAN (C20.2 J2.1 U6.3), SHDN-BSPD-S08-V00-Buzzer (J4.1)
12V: SHDN-BSPD-S10-V00-Connectivity (J6.1), SHDN-BSPD-S02-V00-BSPDSystem/SHDN-BSPD-S03-V00-BSPDWindowComparitor (6 pins), SHDN-BSPD-S02-V00-BSPDSystem/SHDN-BSPD-S03-V00-BSPDWindowComparitor (6 pins), SHDN-BSPD-S07-V00-PSU (C22.2 C23.2 U7.4 U7.5), SHDN-BSPD-S09-V00-ShutdownRelay (D3.K K1.1 R30.2)
GND: SHDN-BSPD-S01-V00-BSPDBoard (M1.1 M2.1 M3.1 M4.1), SHDN-BSPD-S10-V00-Connectivity (J6.5), SHDN-BSPD-S02-V00-BSPDSystem (C1.1 U1.7), SHDN-BSPD-S02-V00-BSPDSystem/SHDN-BSPD-S03-V00-BSPDWindowComparitor (11 pins), SHDN-BSPD-S04-V00-BSPDDelay (8 pins), SHDN-BSPD-S02-V00-BSPDSystem/SHDN-BSPD-S03-V00-BSPDWindowComparitor (11 pins), SHDN-BSPD-S07-V00-PSU (8 pins), SHDN-BSPD-S09-V00-ShutdownRelay (Q2.S R29.1), SHDN-BSPD-S05-V00-Microcontroller (23 pins), SHDN-BSPD-S06-V00-IsolatedCAN (C20.1 D1.3 U6.2 U6.8), SHDN-BSPD-S08-V00-Buzzer (Q1.S R27.2)
5KW SIGNAL IN: SHDN-BSPD-S10-V00-Connectivity (J6.6), SHDN-BSPD-S02-V00-BSPDSystem/SHDN-BSPD-S03-V00-BSPDWindowComparitor (R2A.2 U2A.2 U2A.5)
BSPD1: SHDN-BSPD-S02-V00-BSPDSystem (U1.1), SHDN-BSPD-S02-V00-BSPDSystem/SHDN-BSPD-S03-V00-BSPDWindowComparitor (R1B.1 U2B.1)
BSPD2: SHDN-BSPD-S02-V00-BSPDSystem (U1.2), SHDN-BSPD-S02-V00-BSPDSystem/SHDN-BSPD-S03-V00-BSPDWindowComparitor (R3B.1 U2B.7)
BSPD5: SHDN-BSPD-S02-V00-BSPDSystem (U1.4), SHDN-BSPD-S02-V00-BSPDSystem/SHDN-BSPD-S03-V00-BSPDWindowComparitor (R1A.1 U2A.1)
BSPD6: SHDN-BSPD-S02-V00-BSPDSystem (U1.5), SHDN-BSPD-S02-V00-BSPDSystem/SHDN-BSPD-S03-V00-BSPDWindowComparitor (R3A.1 U2A.7)
BSPD9: SHDN-BSPD-S02-V00-BSPDSystem (U1.8), SHDN-BSPD-S04-V00-BSPDDelay (R14.1)
BSPD10: SHDN-BSPD-S04-V00-BSPDDelay (U3.1), SHDN-BSPD-S09-V00-ShutdownRelay (R28.1 R30.1)
CHAIN IN: SHDN-BSPD-S10-V00-Connectivity (J6.7), SHDN-BSPD-S09-V00-ShutdownRelay (K1.4)
CHAIN LED: SHDN-BSPD-S10-V00-Connectivity (J5.1), SHDN-BSPD-S09-V00-ShutdownRelay (K1.6)
CHAIN OUT: SHDN-BSPD-S10-V00-Connectivity (J6.3), SHDN-BSPD-S09-V00-ShutdownRelay (K1.8)
DET LED: SHDN-BSPD-S10-V00-Connectivity (J5.2), SHDN-BSPD-S09-V00-ShutdownRelay (K1.11)
DETECTION IN: SHDN-BSPD-S10-V00-Connectivity (J6.8), SHDN-BSPD-S09-V00-ShutdownRelay (K1.13)
DETECTION OUT: SHDN-BSPD-S10-V00-Connectivity (J6.4), SHDN-BSPD-S09-V00-ShutdownRelay (K1.9)
PEDAL IN: SHDN-BSPD-S10-V00-Connectivity (J6.2), SHDN-BSPD-S02-V00-BSPDSystem/SHDN-BSPD-S03-V00-BSPDWindowComparitor (R2B.2 U2B.2 U2B.5)